# EAGLE schematic MicroMouse_v0 (EAGLE 7.7.0)
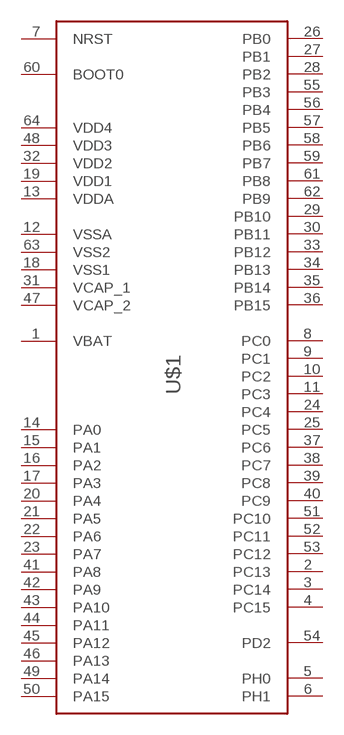
[diagram p0: schematic, sheet 1]

## Parts
U$1  STM32F405XXSTM32F405XX  [LQFP64]
Unconnected: U$1.2(PC13) U$1.3(PC14) U$1.4(PC15) U$1.5(PH0) U$1.6(PH1) U$1.7(NRST) U$1.8(PC0) U$1.9(PC1) U$1.10(PC2) U$1.11(PC3) U$1.14(PA0) U$1.15(PA1) U$1.16(PA2) U$1.17(PA3) U$1.20(PA4) U$1.21(PA5) U$1.22(PA6) U$1.23(PA7) U$1.24(PC4) U$1.25(PC5) U$1.26(PB0) U$1.27(PB1) U$1.28(PB2) U$1.29(PB10) U$1.30(PB11) U$1.33(PB12) U$1.34(PB13) U$1.35(PB14) U$1.36(PB15) U$1.37(PC6) U$1.38(PC7) U$1.39(PC8) U$1.40(PC9) U$1.41(PA8) U$1.42(PA9) U$1.43(PA10) U$1.44(PA11) U$1.45(PA12) U$1.46(PA13) U$1.49(PA14) U$1.50(PA15) U$1.51(PC10) U$1.52(PC11) U$1.53(PC12) U$1.54(PD2) U$1.55(PB3) U$1.56(PB4) U$1.57(PB5) U$1.58(PB6) U$1.59(PB7) U$1.60(BOOT0) U$1.61(PB8) U$1.62(PB9)

## Power pins joined to a net without a drawn wire
VBAT: U$1.1(VBAT)
VCAP_1: U$1.31(VCAP_1)
VCAP_2: U$1.47(VCAP_2)
VDD1: U$1.19(VDD1)
VDD2: U$1.32(VDD2)
VDD3: U$1.48(VDD3)
VDD4: U$1.64(VDD4)
VDDA: U$1.13(VDDA)
VSS1: U$1.18(VSS1)
VSS2: U$1.63(VSS2)
VSSA: U$1.12(VSSA)

## Library data of the parts
U$1 = stm32f:STM32F405XX: Features • Core: ARM 32-bit Cortex™-M4 CPU with FPU, Adaptive real-time accelerator (ART Accelerator™) allowing 0-wait state execution from Flash memory, frequency up to 168 MHz, memory protection unit, 210 DMIPS/ 1.25 DMIPS/MHz (Dhrystone 2.1), and DSP instructions • Memories – Up to 1 Mbyte of Flash memory – Up to 192+4 Kbytes of SRAM including 64- Kbyte of CCM (core coupled memory) data RAM – Flexible static memory controller supporting Compact Flash, SRAM, PSRAM, NOR and NAND memories • LCD parallel interface, 8080/6800 modes • Clock, reset and supply management – 1.8 V to 3.6 V application supply and I/Os – POR, PDR, PVD and BOR – 4-to-26 MHz crystal oscillator – Internal 16 MHz factory-trimmed RC (1% accuracy) – 32 kHz oscillator for RTC with calibration – Internal 32 kHz RC with calibration • Low power – Sleep, Stop and Standby modes – VBAT supply for RTC, 20×32 bit backup registers + optional 4 KB backup SRAM • 3×12-bit, 2.4 MSPS A/D converters: up to 24 channels and 7.2 MSPS in triple interleaved mode • 2×12-bit D/A converters • General-purpose DMA: 16-stream DMA controller with FIFOs and burst support • Up to 17 timers: up to twelve 16-bit and two 32- bit timers up to 168 MHz, each with up to 4 IC/OC/PWM or pulse counter and quadrature (incremental) encoder input • Debug mode – Serial wire debug (SWD) & JTAG interfaces – Cortex-M4 Embedded Trace Macrocell™ • Up to 140 I/O ports with interrupt capability – Up to 136 fast I/Os up to 84 MHz – Up to 138 5 V-tolerant I/Os • Up to 15 communication interfaces – Up to 3 × I2C interfaces (SMBus/PMBus) – Up to 4 USARTs/2 UARTs (10.5 Mbit/s, ISO 7816 interface, LIN, IrDA, modem control) – Up to 3 SPIs (42 Mbits/s), 2 with muxed full-duplex I2S to achieve audio class accuracy via internal audio PLL or external clock – 2 × CAN interfaces (2.0B Active) – SDIO interface • Advanced connectivity – USB 2.0 full-speed device/host/OTG controller with on-chip PHY – USB 2.0 high-speed/full-speed device/host/OTG controller with dedicated DMA, on-chip full-speed PHY and ULPI – 10/100 Ethernet MAC with dedicated DMA: supports IEEE 1588v2 hardware, MII/RMII • 8- to 14-bit parallel camera interface up to 54 Mbytes/s • True random number generator • CRC calculation unit • 96-bit unique ID • RTC: subsecond accuracy, hardware calendar

## Net classes
0 default: clearance 0.205 mm